# EAGLE board Aquila_mobile (EAGLE 6.3), part 1 of 2
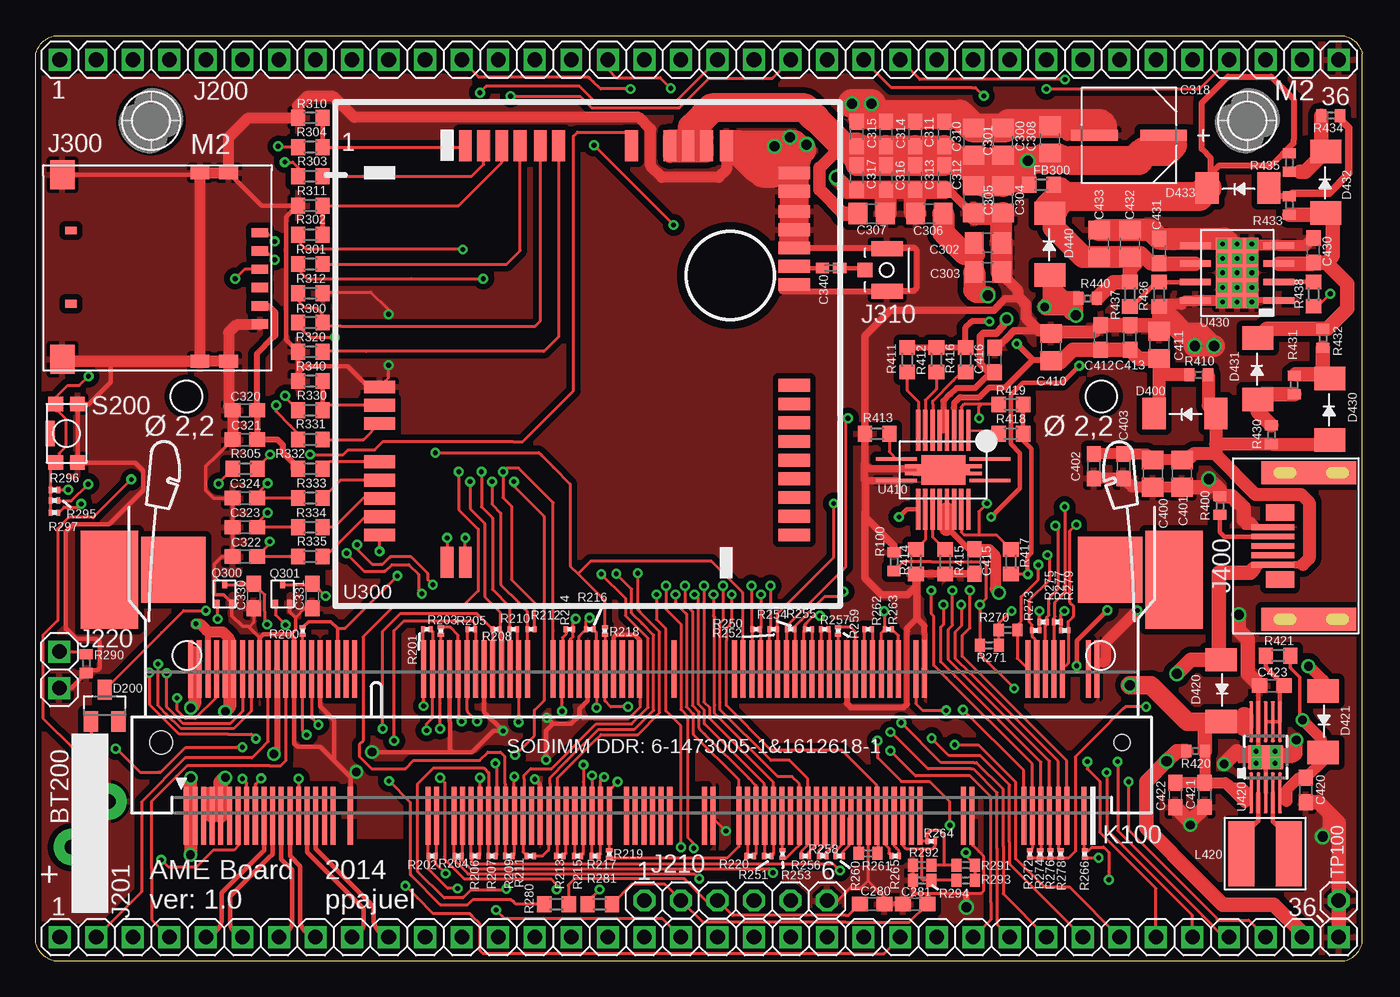
[diagram p6: board, top side]
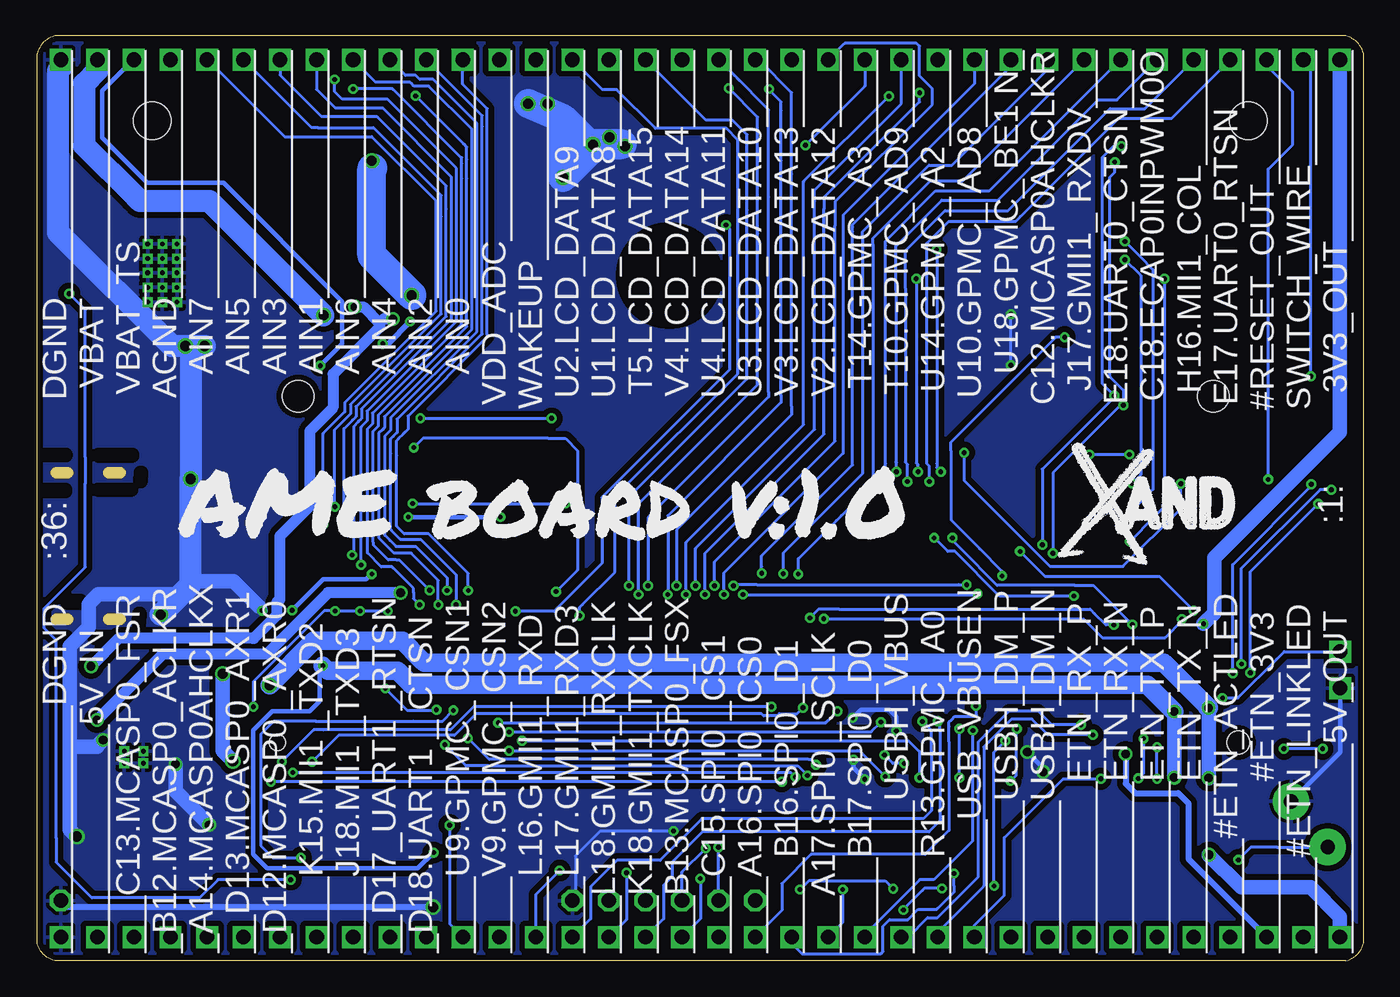
[diagram p7: board, bottom side, seen from below]

Size 92.2 x 64.26 mm. Coordinates in mm from the lower left corner, seen from the top.
Outline: 1.22,0 90.98,0 arc60 92.2,1.22 92.2,63.04 arc60 90.98,64.26 1.22,64.26 arc60 0,63.04 0,1.22 arc60 1.22,0
Copper layers (1*16): Top 0.0356mm / dielectric 1.5011mm / Bottom 0.0356mm
Design rules "LaenPCBOrder": minimum track width 6mil, minimum drill 13mil, track to track 6mil, track to pad 6mil, pad to pad 6mil, via to via 6mil, smd to smd 6mil, copper to edge 15mil, drill to drill 6mil, minimum pad ring 7mil, minimum via ring 7mil, stop-mask expansion 3mil, vias tented up to drill 0mil, thermal gap 10mil
Net classes: 0 default: width 0.203 mm, drill 0.33 mm, clearance 0.152 mm
tKeepout: area 51.7,48.8 to 53.7,49; area 51.7,47.5 to 53.7,47.7
tRestrict: area 46.9,46.2 to 49.7,49; area 53.9,48.6 to 57.9,49.2; area 53.9,46.8 to 57.9,47.6; area 60.4,46.9 to 60.8,49.2; area 50.9,48.8 to 51.5,49.5; area 58.1,47.2 to 60.2,48.8; area 20.3,7.4 to 25.8,8; area 50.9,46.6 to 51.5,47.3
bRestrict: area 46.9,46.2 to 49.7,49; area 87.1,22.5 to 88.2,22.5; area 85.6,32.7 to 88,32.7; area 85.6,35.1 to 87.9,35.2; area 85,33.3 to 85,33.9; area 90.2,35.1 to 91.7,35.2; area 90.2,32.6 to 91.7,32.7; area 89.2,24.9 to 90.1,25; area 85.1,23.5 to 85.1,24.1; area 90.2,22.4 to 90.7,22.5

## Footprints (pad centres in the part's own frame; a part is rotated, then mirrored left to right if it is on the bottom)
VL-1220/VCN = drill 1 pad 2.54: 1 2.54,3.175; 2 0,0
C0603 = smd 1.1 x 1: 1 -0.85,0; 2 0.85,0
C0805 = smd 1.3 x 1.5: 1 -0.95,0; 2 0.95,0
CAPAE660X800N = smd 3.251 x 0.762: 1 -2.413,0; 2 2.413,0
C0402K = smd 0.925 x 0.74: 1 -0.6,0; 2 0.6,0
SOT23 = smd 1 x 1.4: 1 -0.95,-1.1; 2 0.95,-1.1; 3 0,1.1
SMB = smd 1.62 x 2.18: 1 0.8,1.1; 2 5.08,1.1
R0603 = smd 1 x 1.1: 1 -0.85,0; 2 0.85,0
5,0 = hole 2.6: 0,0
HOLE-2.2 = hole 2.2: 0,0
1X36 = drill 1.016 square: 1 -49.53,0; 2 -46.99,0; 3 -44.45,0; 4 -41.91,0; 5 -39.37,0; 6 -36.83,0; 7 -34.29,0; 8 -31.75,0; 9 -29.21,0; 10 -26.67,0; 11 -24.13,0; 12 -21.59,0; 13 -19.05,0; 14 -16.51,0; 15 -13.97,0; 16 -11.43,0; 17 -8.89,0; 18 -6.35,0; 19 -3.81,0; 20 -1.27,0; 21 1.27,0; 22 3.81,0; 23 6.35,0; 24 8.89,0; 25 11.43,0; 26 13.97,0; 27 16.51,0; 28 19.05,0; 29 21.59,0; 30 24.13,0; 31 26.67,0; 32 29.21,0; 33 31.75,0; 34 34.29,0; 35 36.83,0; 36 39.37,0
1X06 = drill 1.016 octagon: 1 -6.35,0; 2 -3.81,0; 3 -1.27,0; 4 1.27,0; 5 3.81,0; 6 6.35,0
1X02 = drill 1.016 square: 1 -1.27,0; 2 1.27,0
78646-3001 = smd 1.15 x 0.65: C1 0,9.025; C2 0,6.485; C3 0,3.945; C5 0,10.295; C6 0,7.755; C7 0,5.215 | smd 1.3 x 0.9: GND1 2.17,12.87; GND2 4.17,12.87; GND5 4.17,-0.225; GND6 2.17,-0.225 | smd 1.7 x 2: GND3 13.73,12.73; GND4 13.73,-0.08 | smd 0.8 x 0.54: X1 13.15,8.87; X2 13.15,3.79
U.FL_RECEPTACLE = smd 1.05 x 1: 1 0,0 | smd 2.2 x 1.05: 2 1.525,1.475; 3 1.525,-1.475
10103593-0001LF = smd 0.4 x 3: 1 -1.3,4.5; 2 -0.65,4.5; 3 0,4.5; 4 0.65,4.5; 5 1.3,4.5 | smd 1.15 x 2: P$6 2.32,4; P$7 -2.32,4 | smd 1.6 x 6.6: P$8 -5.1,2; P$9 5.1,2
1-1376408-1_REDUCED = smd 0.35 x 4: 1 -31.65,-5.1; 2 -31.35,5.1; 3 -31.05,-5.1; 4 -30.75,5.1; 5 -30.45,-5.1; 6 -30.15,5.1; 7 -29.85,-5.1; 8 -29.55,5.1; 9 -29.25,-5.1; 10 -28.95,5.1; 11 -28.65,-5.1; 12 -28.35,5.1; 13 -28.05,-5.1; 14 -27.75,5.1; 15 -27.45,-5.1; 16 -27.15,5.1; 17 -26.85,-5.1; 18 -26.55,5.1; 19 -26.25,-5.1; 20 -25.95,5.1; 21 -25.65,-5.1; 22 -25.35,5.1; 23 -25.05,-5.1; 24 -24.75,5.1; 25 -24.45,-5.1; 26 -24.15,5.1; 27 -23.85,-5.1; 28 -23.55,5.1; 29 -23.25,-5.1; 30 -22.95,5.1; 31 -22.65,-5.1; 32 -22.35,5.1; 33 -22.05,-5.1; 34 -21.75,5.1; 35 -21.45,-5.1; 36 -21.15,5.1; 38 -20.55,5.1; 39 -20.25,-5.1; 40 -19.95,5.1; 44 -15.15,5.1; 45 -14.85,-5.1; 46 -14.55,5.1; 47 -14.25,-5.1; 48 -13.95,5.1; 50 -13.35,5.1; 51 -13.05,-5.1; 52 -12.75,5.1; 53 -12.45,-5.1; 54 -12.15,5.1; 55 -11.85,-5.1; 56 -11.55,5.1; 57 -11.25,-5.1; 58 -10.95,5.1; 59 -10.65,-5.1; 60 -10.35,5.1; 61 -10.05,-5.1; 62 -9.75,5.1; 63 -9.45,-5.1; 64 -9.15,5.1; 65 -8.85,-5.1; 66 -8.55,5.1; 67 -8.25,-5.1; 68 -7.95,5.1; 69 -7.65,-5.1; 71 -7.05,-5.1; 73 -6.45,-5.1; 74 -6.15,5.1; 75 -5.85,-5.1; 76 -5.55,5.1; 77 -5.25,-5.1; 78 -4.95,5.1; 79 -4.65,-5.1; 80 -4.35,5.1; 81 -4.05,-5.1; 82 -3.75,5.1; 83 -3.45,-5.1; 84 -3.15,5.1; 85 -2.85,-5.1; 86 -2.55,5.1; 87 -2.25,-5.1; 88 -1.95,5.1; 90 -1.35,5.1; 91 -1.05,-5.1; 92 -0.75,5.1; 93 -0.45,-5.1; 94 -0.15,5.1; 95 0.15,-5.1; 97 0.75,-5.1; 99 1.35,-5.1; 101 1.95,-5.1; 102 2.25,5.1; 109 4.35,-5.1; 111 4.95,-5.1; 116 6.45,5.1; 117 6.75,-5.1; 118 7.05,5.1; 119 7.35,-5.1; 120 7.65,5.1; 121 7.95,-5.1; 122 8.25,5.1; 123 8.55,-5.1; 124 8.85,5.1; 125 9.15,-5.1; 126 9.45,5.1; 127 9.75,-5.1; 128 10.05,5.1; 129 10.35,-5.1; 130 10.65,5.1; 131 10.95,-5.1; 132 11.25,5.1; 133 11.55,-5.1; 134 11.85,5.1; 135 12.15,-5.1; 136 12.45,5.1; 137 12.75,-5.1; 138 13.05,5.1; 139 13.35,-5.1; 140 13.65,5.1; 141 13.95,-5.1; 142 14.25,5.1; 143 14.55,-5.1; 144 14.85,5.1; 145 15.15,-5.1; 146 15.45,5.1; 147 15.75,-5.1; 148 16.05,5.1; 149 16.35,-5.1; 150 16.65,5.1; 151 16.95,-5.1; 152 17.25,5.1; 153 17.55,-5.1; 154 17.85,5.1; 155 18.15,-5.1; 157 18.75,-5.1; 158 19.05,5.1; 159 19.35,-5.1; 160 19.65,5.1; 169 22.35,-5.1; 171 22.95,-5.1; 183 26.55,-5.1; 184 26.85,5.1; 185 27.15,-5.1; 186 27.45,5.1; 187 27.75,-5.1; 188 28.05,5.1; 189 28.35,-5.1; 190 28.65,5.1; 191 28.95,-5.1; 192 29.25,5.1; 193 29.55,-5.1; 197 30.75,-5.1; 198 31.05,5.1; 200 31.65,5.1 | smd 4.5 x 4.6: M1 -32.55,12; M2 32.55,12 | smd 4 x 6.8: M3 -37,11.3; M4 37,11.3 | hole 1.6: -33.4,0 | hole 1.1: 33.4,0
SDR0403 = smd 4.5 x 1.8: 1 0,1.65; 2 0,-1.65
SOT-416 = smd 0.356 x 0.508: 1 -0.5,0; 2 0.5,0; 3 0,1.295
R0402 = smd 0.7 x 0.9: 1 -0.65,0; 2 0.65,0
R0201 = smd 0.28 x 0.43: 1 -0.255,0; 2 0.255,0
KMR231G = smd 1.016 x 1.016: 1 1.524,4.064; 2 0,4.064; 3 0,0; 4 1.524,0 | smd 0.635 x 1.778: 5 1.905,2.032
1X01 = drill 1.016 octagon: 1 0,0
QUECTEL_M10 = smd 2.159 x 0.889: 8 0,12.192; 9 0,10.922; 10 0,9.652; 12 0,6.985; 13 0,5.715; 14 0,4.445; 15 0,3.175; 16 0,1.905; 33 28.829,1.905; 34 28.829,3.205; 35 28.829,4.505; 36 28.829,5.805; 37 28.829,7.105; 38 28.829,8.405; 39 28.829,9.705; 40 28.829,11.005; 41 28.829,12.305; 42 28.829,19.304; 43 28.829,20.574; 44 28.829,21.844; 45 28.829,23.114; 46 28.829,24.384; 47 28.829,25.781; 48 28.829,27.051 | smd 0.889 x 2.159: 17 4.699,0; 18 5.969,0; 49 24.13,28.956; 50 22.733,28.956; 51 21.463,28.956; 52 20.193,28.956; 54 17.526,28.956; 58 12.446,28.956; 59 11.176,28.956; 60 9.779,28.956; 61 8.509,28.956; 62 7.239,28.956; 63 5.969,28.956
BQ24032ARHLR = smd 2.85 x 0.25: 1 -3.25,-0.75; 10 3.25,-0.75; 11 3.25,0.75; 20 -3.25,0.75 | smd 0.3 x 2.85: 2 -1.75,-2.75; 3 -1.25,-2.75; 4 -0.75,-2.75; 5 -0.25,-2.75; 6 0.25,-2.75; 7 0.75,-2.75; 8 1.25,-2.75; 9 1.75,-2.75; 12 1.75,2.75; 13 1.25,2.75; 14 0.75,2.75; 15 0.25,2.75; 16 -0.25,2.75; 17 -0.75,2.75; 18 -1.25,2.75; 19 -1.75,2.75 | smd 3.05 x 2.05: 21 0,0 | smd 0.85 x 0.25: P$18 -2.25,-0.25; P$19 2.25,-0.25; P$20 -2.25,0.25; P$23 2.25,0.25 | smd 0.5 x 0.75: P$26 -1.6,0; P$27 1.6,0
DRC-S-PVSON-N10 = smd 0.28 x 2.85: 1 -1,-2.475; 2 -0.5,-2.475; 3 0,-2.475; 4 0.5,-2.475; 5 1,-2.475; 6 1,2.475; 7 0.5,2.475; 8 0,2.475; 9 -0.5,2.475; 10 -1,2.475 | drill 0.33 pad 0.61 square: EXP@1 -0.662,0.412; EXP@2 -0.659,-0.413; EXP@3 0.662,0.412; EXP@4 0.662,-0.413 | smd 2.4 x 1.65: TH 0,0
8SO_POWERPAD = smd 0.45 x 2.15: 1 -1.905,-2.9; 2 -0.635,-2.9; 3 0.635,-2.9; 4 1.905,-2.9; 5 1.905,2.9; 6 0.635,2.9; 7 -0.635,2.9; 8 -1.905,2.9 | drill 0.33 pad 0.61 square: EXP@1 -2.032,1.016; EXP@2 0,1.016; EXP@6 2.007,1.016; EXP@7 -1.016,1.016; EXP@8 -2.032,0; EXP@9 -2.032,-1.016; EXP@10 -1.016,0; EXP@11 2.007,-1.016; EXP@14 0.991,1.016; EXP@15 -1.016,-1.016; EXP@16 0,0; EXP@17 0,-1.016; EXP@18 0.991,-1.016; EXP@24 2.007,0; EXP@25 0.991,0 | smd 4.9 x 2.95: TERM 0,0

## Placement (x,y rotation side)
BT200  VL-1220/VCN  [VL-1220/VCN]  5.03,11.07 180 top
C280  47p  [C0603]  58.12,3.94 0 top
C281  47p  [C0603]  61.11,3.94 180 top
C300  47u  [C0805]  67.21,56.92 90 top
C301  47u  [C0805]  65.18,56.92 90 top
C302  47u  [C0805]  66.17,49.89 0 top
C303  47u  [C0805]  66.17,47.85 0 top
C304  47u  [C0805]  67.21,52.9 270 top
C305  47u  [C0805]  65.18,52.91 270 top
C306  47u  [C0805]  62.1,51.92 180 top
C307  47u  [C0805]  58.09,51.92 0 top
C308  47u  [C0805]  70.48,57.07 90 top
C310  100n  [C0603]  63.14,57.45 270 top
C311  100n  [C0603]  61.11,57.45 270 top
C312  100n  [C0603]  63.14,54.43 90 top
C313  100n  [C0603]  61.11,54.43 90 top
C314  47p  [C0603]  59.08,57.45 270 top
C315  47p  [C0603]  57.05,57.45 270 top
C316  47p  [C0603]  59.08,54.43 90 top
C317  47p  [C0603]  57.05,54.43 90 top
C318  680u  [CAPAE660X800N]  75.97,57.35 180 top
C320  47p  [C0603]  14.53,38.25 180 top
C321  100n  [C0603]  14.53,36.22 180 top
C322  47p  [C0603]  14.53,28.09 180 top
C323  47p  [C0603]  14.53,30.12 180 top
C324  47p  [C0603]  14.53,32.16 180 top
C330  100n  [C0603]  15.14,25.35 270 top
C331  100n  [C0603]  19.2,25.35 270 top
C340  22p  [C0402K]  55.27,48.13 0 top
C400  47u  [C0805]  77.62,33.86 270 top
C401  47u  [C0805]  79.65,33.86 270 top
C402  100n  [C0603]  73.53,34.37 270 top
C403  47p  [C0603]  75.59,34.37 270 top
C410  47u  [C0805]  70.56,42.65 90 top
C411  47u  [C0805]  78.08,42.8 90 top
C412  100n  [C0603]  74.02,43.31 90 top
C413  47p  [C0603]  76.05,43.31 90 top
C415  10u  [C0603]  65.23,27.74 90 top
C416  10u  [C0603]  66.65,41.76 270 top
C420  10u  [C0603]  88.27,11.86 270 top
C421  10u  [C0603]  81.24,11.53 270 top
C422  10u  [C0603]  79.2,11.53 270 top
C423  100n  [C0603]  85.9,19.13 180 top
C430  10u  [C0603]  88.8,49.38 90 top
C431  10u  [C0603]  78.08,49.33 90 top
C432  47u  [C0805]  76.05,49.83 90 top
C433  47u  [C0805]  73.89,49.83 90 top
D200  BAS40  [SOT23]  4.78,17.73 0 top
D400  STPS340U  [SMB]  82.8,39.14 180 top
D420  STPS340U  [SMB]  81.28,21.72 270 top
D421  STPS340U  [SMB]  88.37,19.56 270 top
D430  STPS340U  [SMB]  91.03,35.38 90 top
D431  STPS340U  [SMB]  86.03,38.2 90 top
D432  STPS340U  [SMB]  90.75,51.16 90 top
D433  STPS340U  [SMB]  86.49,54.79 180 top
D440  STPS340U  [SMB]  71.58,46.86 90 top
FB300  BLM18S  [R0603]  69.88,53.92 180 top
H1  MOUNT-HOLE-M2  [5,0]  84.2,58.37 0 top
H2  MOUNT-HOLE-M2  [5,0]  8,58.37 0 top
H5  MOUNT_HOLE_2.2  [HOLE-2.2]  74.05,39.23 0 top
H6  MOUNT_HOLE_2.2  [HOLE-2.2]  10.45,39.23 0 top
J200  DNI  [1X36]  51.18,62.61 0 top
J201  DNI  [1X36]  51.18,1.65 0 top
J210  DNI  [1X06]  48.64,4.19 180 top
J220  DNI  [1X02]  1.63,20.22 270 top
J300  78646-3001  [78646-3001]  15.57,54.53 180 top
J310  U.FL_CONNECTOR  [U.FL_RECEPTACLE]  57.63,48.01 0 top
J400  10103593  [10103593-0001LF]  90.47,28.83 90 top
K100  1376408-1_DDR1_1.8V_REDUCED  [1-1376408-1_REDUCED]  42.1,15.18 0 top
L420  SDR0403-2R2ML  [SDR0403]  85.45,7.44 270 top
Q300  DTC143ZET1G  [SOT-416]  13.11,24.84 0 top
Q301  DTC143ZET1G  [SOT-416]  17.14,24.84 0 top
R100  0R  [R0402]  59.64,27.74 270 top
R200  0R  [R0201]  18.54,22.91 90 top
R201  0R  [R0201]  27.18,23.04 0 top
R202  0R  [R0201]  27.53,7.29 0 top
R203  0R  [R0201]  28.14,22.91 90 top
R204  0R  [R0201]  29.34,7.29 0 top
R205  0R  [R0201]  30.25,23.04 0 top
R206  0R  [R0201]  30.52,7.29 0 top
R207  0R  [R0201]  31.7,7.29 0 top
R208  0R  [R0201]  31.98,23.04 0 top
R209  0R  [R0201]  32.87,7.29 0 top
R210  0R  [R0201]  33.17,23.04 0 top
R211  0R  [R0201]  34.37,7.29 0 top
R212  0R  [R0201]  34.42,23.04 0 top
R213  0R  [R0201]  36.42,7.29 0 top
R214  0R  [R0201]  37.08,23.04 0 top
R215  0R  [R0201]  37.64,7.29 0 top
R216  0R  [R0201]  38.51,23.04 0 top
R217  0R  [R0201]  38.86,7.29 0 top
R218  0R  [R0201]  39.55,22.91 90 top
R219  0R  [R0201]  39.85,7.42 270 top
R220  0R  [R0201]  49.66,7.29 0 top
R250  0R  [R0201]  50.05,23.04 0 top
R251  0R  [R0201]  50.88,7.29 0 top
R252  0R  [R0201]  51.25,23.04 0 top
R253  0R  [R0201]  51.89,7.42 270 top
R254  0R  [R0201]  52.47,23.04 0 top
R255  0R  [R0201]  53.7,23.04 0 top
R256  0R  [R0201]  53.47,7.29 0 top
R257  0R  [R0201]  54.82,23.04 0 top
R258  0R  [R0201]  54.69,7.29 0 top
R259  0R  [R0201]  55.75,22.91 90 top
R260  0R  [R0201]  55.83,7.29 0 top
R261  0R  [R0402]  57.84,7.47 0 top
R262  0R  [R0201]  57.84,23.04 0 top
R263  0R  [R0201]  59.26,23.04 0 top
R264  0R  [R0201]  62.23,8.31 0 top
R265  0R  [R0201]  59.72,7.29 180 top
R266  0R  [R0201]  72.9,7.42 90 top
R270  1K  [R0402]  67.56,22.99 180 top
R271  1K  [R0402]  66.27,21.92 0 top
R272  0R  [R0201]  69.09,7.42 90 top
R273  0R  [R0201]  69.49,22.96 180 top
R274  0R  [R0201]  69.8,7.42 90 top
R275  0R  [R0201]  70,23.55 0 top
R276  0R  [R0201]  70.51,7.42 90 top
R277  0R  [R0201]  70.99,23.55 180 top
R278  0R  [R0201]  71.22,7.42 90 top
R279  0R  [R0201]  71.5,22.96 0 top
R280  1K  [R0603]  36.2,3.94 180 top
R281  1K  [R0603]  39.19,3.94 180 top
R290  0R  [R0402]  3.51,20.65 90 top
R291  10K  [R0402]  64.62,6.65 0 top
R292  10K  [R0402]  61.59,6.65 0 top
R293  10K  [R0402]  64.62,5.59 0 top
R294  10K  [R0402]  61.59,5.59 0 top
R295  0R  [R0201]  1.3,31.98 180 top
R296  0R  [R0201]  1.3,32.72 180 top
R297  0R  [R0201]  1.3,31.14 180 top
R300  1K  [R0603]  19.08,44.35 0 top
R301  1K  [R0603]  19.08,48.41 0 top
R302  1K  [R0603]  19.08,50.44 0 top
R303  1K  [R0603]  19.08,54.51 0 top
R304  1K  [R0603]  19.08,56.54 0 top
R305  1K  [R0603]  14.53,34.19 0 top
R310  5K6  [R0603]  19.08,58.57 180 top
R311  5K6  [R0603]  19.08,52.48 180 top
R312  5K6  [R0603]  19.08,46.38 0 top
R320  0R  [R0603]  19.08,42.32 180 top
R330  1K  [R0603]  19.08,38.25 0 top
R331  1K  [R0603]  19.08,36.22 0 top
R332  0R  [R0603]  19.08,34.19 0 top
R333  22R  [R0603]  19.08,32.16 0 top
R334  22R  [R0603]  19.08,30.12 0 top
R335  22R  [R0603]  19.08,28.09 0 top
R340  5K6  [R0603]  19.08,40.28 180 top
R400  0R  [R0402]  82.29,31.64 270 top
R410  0R  [R0402]  80.82,40.72 180 top
R411  100K  [R0603]  60.55,41.76 270 top
R412  100K  [R0603]  62.59,41.76 270 top
R413  1K  [R0603]  58.47,36.63 0 top
R414  36K  [R0603]  61.16,27.74 90 top
R415  30K1  [R0603]  63.2,27.74 90 top
R416  100K  [R0603]  64.62,41.76 270 top
R417  100K  [R0603]  67.77,27.74 270 top
R418  100K  [R0603]  67.77,36.63 0 top
R419  100K  [R0603]  67.77,38.66 0 top
R420  0R  [R0402]  80.6,14.58 0 top
R421  100R  [R0603]  86.33,21.21 0 top
R430  0R  [R0402]  85.88,36.55 90 top
R431  0R  [R0402]  87.45,40.01 90 top
R432  0R  [R0402]  89.46,43.26 90 top
R433  0R  [R0402]  87.12,52.48 90 top
R434  0R  [R0402]  89.99,58.72 180 top
R435  0R  [R0402]  87.12,55.47 90 top
R436  30K1  [R0603]  78.07,46.31 90 top
R437  222740R  [R0603]  76.04,46.32 270 top
R438  1K  [R0603]  88.8,46.33 90 top
R440  0R  [R0402]  73.1,46.02 0 top
S200  KMR231G  [KMR231G]  2.9,38.68 180 top
TP100  DNI  [1X01]  90.55,4.19 0 top
U300  QUECTEL_M10_R  [QUECTEL_M10]  23.88,27.69 0 top
U410  BQ24032ARHLR  [BQ24032ARHLR]  63.07,34.11 180 top
U420  TPS63002DRC  [DRC-S-PVSON-N10]  85.47,14.15 0 top
U430  TPS7A7001  [8SO_POWERPAD]  83.49,47.8 90 top

## Tracks (layer width: path | path; a pad name or v marks a point on that pad's centre or on a via)
5V  (via drill 0.33 pad 0.13)
  Top 0.203: 63.01,42.61 62.76,42.85 | 62.76,42.85 62.97,42.85 62.99,42.85 | 62.76,42.85 62.76,42.78 R412.1
  Top 0.305: U410.4 63.82,38.39 63.8,38.41
  Top 0.406: 63.8,38.41 63.82,38.42 63.82,38.75 64.11,39.04 64.24,39.17 65.58,39.17 66.12,39.7 66.27,39.85 67.39,39.85 68,40.46 69.29,41.76 | 69.29,41.76 70.5,41.76 C410.1 | 78.08,38.4 D400.2 | R411.1 R412.1 R416.1 64.62,44.02 64.95,44.35 65.02,44.42 v66.27,44.42 | 69.29,41.76 v68.17,42.88
  Top 0.889: 78.08,38.4 78.08,40.79 | 78.08,40.79 C411.1 | R410.2 78.16,40.72 78.08,40.79
  Top 1.016: C411.1 76.66,41.85 C413.1 C412.1 72.07,42.46 71.2,41.58 70.68,41.58 C410.1
  Bottom 0.406: v68.17,42.88 67.82,42.88 v66.27,44.42
5V_IN  (via drill 0.7 pad 0.13)
  Top 0.254: 84.66,27.23 85.07,27.23 85.37,27.53
  Top 0.406: 85.38,27.53 J400.1 85.37,27.53 87.53,27.53 | 79.65,34.95 C401.1 79.8,34.95 | 89.32,36.33 D430.1 89.97,36.22 90.55,36.22 90.23,35.9 | 81.95,38.09 D400.1
  Top 0.508: 87.53,27.53 88.06,27.53
  Top 0.762: C401.1 C400.1 77.21,35.22 C403.1 C402.1
  Top 0.889: 88.06,27.53 88.49,27.96 88.49,31.85 87.94,32.41 84.78,32.41 84.73,32.46 81.94,35.26 | 79.8,34.95 80.19,34.95 80.49,35.26 81.94,35.26 | 82,35.92 D400.1 81.47,38.57 R410.1 | 82,35.92 82,35.32 81.94,35.26 | 82,35.92 82.02,35.9 R430.1 89.65,35.9 D430.1
  Top 1.016: J201.35 88.01,1.96 86.06,3.91 82.5,3.91 80.8,5.61 77.17,9.25 77.17,12.45 v78.59,13.87 79.3,14.58 R420.1 | v79.3,19.94 80.28,20.92 D420.1 82.22,21.08 82.22,26.98 84.4,26.98 84.66,27.23
  Bottom 1.016: v79.3,19.94 79.3,14.58 v78.59,13.87
5V_OUT  (via drill 0.6, 0.6 pad 0.13, 0.7 pad 0.13)
  Top 0.203: 11.02,21.44 10.75,21.17 K100.2 K100.4
  Top 0.254: 83.95,16.61 83.95,16.94 84,16.99 | 83.97,16.28 84.13,16.28 U420.10 | 82.86,12.27 83.88,12.27 U420.1
  Top 0.305: 10.77,10.36 K100.3 10.74,9.77 | 82.41,16.61 D420.2
  Top 0.356: K100.1 K100.3 | C421.1 81.47,12.38
  Top 0.406: 10.77,10.36 10.77,10.39 | 82.88,16.61 82.41,16.61 D420.2
  Top 0.762: R420.2 81.25,12.39 C421.1 C422.1 | 81.47,12.38 82.66,12.38 84.05,11 84.05,11.79 83.92,11.91 83.21,11.91 82.86,12.27
  Top 0.914: 11.02,21.44 11.02,17.83 v10.77,17.58 | 10.77,10.39 v10.77,12.7 | 10.74,9.77 v10.74,7.37
  Top 1.016: 82.88,16.61 83.95,16.61 | R420.2 81.25,16.43 81.43,16.61
  Top 1.27: v76.05,19.15 77.5,19.15 78.56,18.09 79.65,16.99 80.03,16.61 81.43,16.61 82.88,16.61 | 84,16.99 84,16.31 83.97,16.28
  Bottom 1.016: v10.77,17.58 v10.77,12.7 | v10.74,7.37 10.74,7.34 8.51,5.11 3.68,5.11 1.65,3.07 J201.1
  Bottom 1.27: 10.87,17.58 v10.77,17.58 13.89,20.7 65.28,20.7 65.35,20.78 65.43,20.85 65.53,20.95 66.8,22.23 72.97,22.23 v76.05,19.15
#ETN_ACTLED
  Top 0.203: K100.24 17.37,20.26 17.37,14.71 17.37,13.92 17.02,13.56 16.23,13.56 10.62,13.56 10.59,13.56 10.57,13.56 10.52,13.56 9.91,12.95 | 9.91,12.95 9.78,12.83 | 9.91,12.95 8.05,11.1 8.05,6.4 8.05,2.87 J201.4
#ETN_LINKLED
  Top 0.203: 4.24,1.65 J201.2 6.66,4.12 6.99,4.45 | K100.20 16.15,15.24 15.6,14.68 15.19,14.28 15.01,14.1 10.39,14.1 7.34,11.05 7.34,4.8 | 6.99,4.45 7.06,4.52 7.34,4.8 | 7.34,4.8 6.99,4.45
#POR  (via drill 0.33 pad 0.13)
  Top 0.203: K100.16 14.96,20.27 14.96,17.35 13.74,16.13 10.69,16.13 10.08,16.13 9.07,17.14 8.59,17.63 8.48,17.73 v8.48,20.62 | R296.1 1.58,32.74 v2.23,32.74
  Bottom 0.203: v8.48,20.62 8.48,27.28 3.02,32.74 v2.23,32.74
#POWER_KILL  (via drill 0.33 pad 0.13)
  Top 0.203: 14.35,17.35 14.35,17.33 | K100.14 14.35,17.33 | 14.35,17.33 13.51,16.48 10.26,16.48 10.24,16.48 9.22,17.5 9.09,17.63 v9.09,19.99 | R295.1 1.58,31.95 2.46,31.95 v3.63,33.12
  Bottom 0.203: v9.09,19.99 9.09,27.53 3.63,32.99 v3.63,33.12
#RESET_OUT  (via drill 0.33 pad 0.13)
  Top 0.203: K100.15 14.65,12.35 v14.35,12.65 | v2.85,14.73 2.62,14.73 0.48,16.87 0.48,22.63 1.47,23.62 1.5,23.62 1.5,30.02 2.29,30.81 3.91,30.81 3.99,30.81 v6.63,33.45 | v5.54,14.73 5.61,14.73 6.15,14.2 7.24,13.11 8.53,13.11 8.64,13.11 8.69,13.11 10.41,14.83 v14.35,14.83
  Bottom 0.203: v2.85,14.73 v5.54,14.73 | J200.3 6.73,62.18 4.93,60.38 4.93,56.72 6.63,55.02 v6.63,33.45 | v14.35,12.65 v14.35,14.83
#USBOTG_OC  (via drill 0.33 pad 0.13)
  Top 0.203: R300.1 18.23,44.13 19.02,43.33 v20.78,43.33 | 20.95,23.11 21.49,23.11 v25.12,26.75
  Top 0.254: K100.36 20.95,23.11 20.5,23.57 18.95,23.57 R200.2
  Bottom 0.203: v20.78,43.33 21.39,43.33 27.84,36.88 28.68,36.04 28.68,35.43 28.68,34.72 28.68,30.63 26.67,28.63 25.12,27.08 v25.12,26.75
#WARM_RESET  (via drill 0.33 pad 0.13)
  Top 0.203: K100.17 15.25,12.28 15.44,12.47 v15.65,12.68 | v15.29,15.44 14.99,15.75 13.36,15.75 10.72,15.75 9.96,15.75 8.91,16.79 7.9,17.8 7.87,17.83 v7.87,20.02 | R297.1 1.57,31.14 1.96,31.52 2.92,31.52 v3.15,31.75
  Bottom 0.203: v7.87,20.02 7.87,26.72 7.87,27.03 v3.15,31.75 | v15.29,15.44 15.29,13.03 v15.65,12.68
ADCREFERENCE  (via drill 0.33 pad 0.13)
  Top 0.203: R275.1 R273.1 | R273.1 | R279.1 | R273.1 69.75,23.98 69.75,24.13 v69.75,24.31 | R277.1 R279.1 | R279.1 71.25,23.62 71.25,24.08 v71.48,24.31 | R272.1 R274.1 | R272.1 R276.1 | R272.1 R278.1 | R272.1 71.81,7.16 72.21,7.57 72.24,7.59 72.24,14.17 73.79,15.72 75.56,17.5 75.72,17.65 v77.17,17.65 | R270.2 | R270.2 66.91,23.4 v67.82,24.31 | R271.2 R270.2 | R270.2
  Bottom 0.203: v67.82,24.31 v69.75,24.31 v71.48,24.31 72.26,24.31 77.17,19.41 v77.17,17.65
AGND  (via drill 0.33 pad 0.13)
  Top 0.203: 65.61,21.96 R271.1 | 65.61,21.91 R271.1 | R100.2 59.63,27.08 R100.2 | K100.183 68.65,12.98 68.65,13.23 v64.44,17.45 | R271.1 65.61,21.93 v65.61,24.74 66.04,25.17 66.04,27.61 65.91,27.74 65,27.74 62.23,27.74 60.29,27.74 R100.2 | R271.1 65.62,21.3 v68,18.92 | 80.9,60.58 81.19,60.87 | 81.19,60.87 J200.33 | v70.23,60.58 80.9,60.58 | 80.9,60.58 81.19,60.87
  Bottom 0.203: v65.61,24.74 66.04,25.17 66.04,25.6 66.04,25.88 67.46,27.3 67.54,27.38 68.28,27.38 69.24,28.35 69.24,36.96 69.06,37.13 69.04,37.16 68.91,37.29 68.89,37.31 68.89,38.05 62.69,44.25 62.69,54.36 62.69,55.4 62.69,55.8 62.71,55.8 67.46,60.55 67.49,60.58 69.9,60.58 v70.23,60.58 | v68,18.92 66.5,17.42 64.47,17.42 v64.44,17.45
AIN0  (via drill 0.33)
  Top 0.203: R272.2 69.25,7.84 K100.185 69.25,13.68 63.3,19.63 62.41,20.52 62.41,23.95 62.23,24.13 v62.23,25.73
  Bottom 0.203: v62.23,25.73 62.23,26.92 62.79,27.48 64.87,29.57 64.97,29.67 66.67,29.67 67.13,30.12 67.21,30.2 67.21,35.13 67.21,36.14 67.08,36.27 67.06,36.3 66.73,36.63 66.62,36.73 66.42,36.93 66.42,37.85 60.91,43.36 60.91,43.51 60.91,59.21 62.61,60.91 J200.25
AIN1  (via drill 0.33)
  Top 0.203: K100.186 69.55,22.22 69.37,22.4 69.24,22.53 R273.2 69.24,23.34 69.06,23.52 69.06,24.92 69.06,25.09 70.46,26.49 70.46,28.04 v70.31,28.19
  Bottom 0.203: v70.31,28.19 70.26,28.25 70.16,28.35 70.16,37.16 69.88,37.44 69.65,37.67 69.65,38.35 63.4,44.6 63.4,52.93 63.4,54.46 68.2,59.26 71.48,59.26 72.77,60.55 J200.29
AIN2  (via drill 0.33)
  Top 0.203: R274.2 69.85,7.73 K100.187 69.85,13.81 63.91,19.76 62.89,20.78 62.89,23.19 63.07,23.37 v63.07,24.74
  Bottom 0.203: J200.26 61.27,58.73 61.27,57.96 61.27,43.56 61.29,43.54 67.18,37.64 67.18,36.7 67.21,36.68 67.44,36.45 67.61,36.27 67.61,35.26 67.61,29.95 67.59,29.92 67.56,29.9 66.95,29.29 66.93,29.29 65.53,29.29 63.07,26.82 v63.07,24.74
AIN3  (via drill 0.33)
  Top 0.203: K100.188 70.15,23.44 R275.2 70.26,23.88 70.41,24.03 70.41,24.84 70.41,25.2 71.07,25.86 71.07,30.02 v70.87,30.23
  Bottom 0.203: v70.87,30.23 70.87,36.98 70.28,37.57 70.03,37.82 70.03,38.51 63.75,44.78 63.75,52.22 63.75,53.85 68.56,58.65 68.58,58.67 72.44,58.67 75.31,61.54 J200.30
AIN4  (via drill 0.33)
  Top 0.203: R276.2 70.48,7.7 70.48,10.05 K100.189 70.45,13.87 64.36,19.96 63.42,20.9 63.42,23.04 63.7,23.32 v63.7,25.73
  Bottom 0.203: J200.27 66.6,61.52 65.89,61.52 65.61,61.24 64.67,61.24 61.62,58.19 61.62,57.25 61.62,55.63 61.62,43.71 67.61,37.72 67.61,36.88 67.82,36.68 68.02,36.47 68.02,29.57 67.67,29.21 67.26,28.8 65.89,28.8 63.7,26.62 v63.7,25.73
AIN5  (via drill 0.33)
  Top 0.203: 70.75,23.61 R277.2 | 70.75,23.61 K100.190 | 70.75,23.61 70.75,23.84 70.84,23.93 70.84,24.84 70.84,24.92 71.5,25.58 v71.5,31.55
  Bottom 0.203: v71.5,31.55 71.5,36.91 70.74,37.67 70.69,37.72 70.41,38 70.41,38.66 64.11,44.96 64.11,51.71 64.11,53.19 68.81,57.89 72.69,57.89 73.13,57.89 J200.31
AIN6  (via drill 0.33)
  Top 0.203: R278.2 71.05,7.84 K100.191 71.05,13.86 64.95,19.96 63.91,21.01 63.91,22.86 64.29,23.24 64.31,23.27 v64.31,24.74
  Bottom 0.203: J200.28 68.78,61.16 68.68,61.06 66.29,61.06 66.27,61.04 66.22,60.98 66.02,60.78 64.97,60.78 61.98,57.78 61.98,56.74 61.98,54.36 61.98,43.89 68.05,37.82 68.05,37.06 68.2,36.91 68.43,36.68 68.43,29.36 67.89,28.83 67.39,28.32 66.19,28.32 64.31,26.44 v64.31,24.74
AIN7  (via drill 0.33)
  Top 0.203: K100.192 71.76,20.68 R279.2 71.76,23.57 72.06,23.88 72.14,23.95 72.14,24.64 71.88,24.89 71.88,29.87 v72.31,30.3
  Bottom 0.203: v72.31,30.3 72.31,36.65 71.12,37.85 70.81,38.15 70.81,38.79 64.47,45.14 64.47,48.08 64.47,52.81 68.94,57.28 75.01,57.28 80.34,62.61 J200.32
BAT_TS  (via drill 0.33)
  Top 0.305: v72.52,41.35 71.35,40.18 68.61,40.18 67.79,39.37 67.77,39.34 67.77,35.92 68.4,35.28 68.4,32.84 66.98,31.42 v66.4,30.84 | U410.12 60.55,31.39 v59.99,30.84
  Bottom 0.203: v72.52,41.35 72.49,41.35
  Bottom 0.305: J200.34 85.52,62.61 87.68,60.45 87.68,57.17 84.56,54.05 79.25,54.05 71.12,45.92 70.99,45.8 70.99,42.88 71.12,42.75 v72.52,41.35 | v66.4,30.84 v59.99,30.84
BOOT_MODE  (via drill 0.33 pad 0.13)
  Top 0.203: K100.8 | K100.8 12.55,18.31 11.07,16.84 10.41,16.84 10.39,16.84 9.8,17.42 v9.8,18.26 | J220.1 2.49,21.49 3.32,21.49 R290.2
  Bottom 0.203: v9.8,18.26 8.97,18.26 8.74,18.26 6.04,20.95 5.51,21.49 J220.1
C400
  Top 0.305: C340.1 52.83,48.13 U300.43
DEBUG3V3_RX  (via drill 0.33 pad 0.13)
  Top 0.203: C280.1 56.48,3.15 56.29,3.15 52.68,3.15 48.41,3.15 J210.4 46.58,4.19 45.11,5.66 45.11,5.69 37.44,5.69 37.03,5.28 37.03,5.18 37.03,3.95 R280.1 | v17.32,39.27 17.32,39.16 R330.1 | 18.24,56.55 R304.1 16.89,56.54 v16.84,56.59 | v22.33,28.91 22.33,28.6 23.37,27.56 23.98,27.56 24.11,27.56 24.59,28.04 24.61,28.07 26.09,28.07 27.25,26.9 27.25,26.49 27.25,26.47 v27.58,26.14 | v43.79,26.06 43.79,24.43 44.81,23.42 44.83,23.39 44.83,17.48 45.34,16.97 45.34,16.92 45.34,8.53 45.47,8.41 45.72,8.15 v45.72,7.82
  Bottom 0.203: v22.33,28.91 22.33,29.01 22.33,34.16 17.32,39.17 v17.32,39.27 18.16,40.11 18.16,55.83 17.4,56.59 v16.84,56.59 | v43.79,26.06 43.71,26.14 42.16,26.14 28.14,26.14 v27.58,26.14 | J210.4 47.37,6.17 v45.72,7.82
DEBUG3V3_TX  (via drill 0.33 pad 0.13)
  Top 0.203: 40.04,4.14 R281.1 41.41,5.31 43.71,5.31 J210.5 46.35,2.67 48.92,2.67 56.31,2.67 60.59,2.67 60.69,2.67 C281.1 | v17.3,55.5 17.86,55.5 18.24,55.12 R303.1 | 18.24,36.23 R331.1 18.23,36.64 17.68,37.19 16.69,38.18 v16.69,38.61 | v21.59,28.32 21.59,28.3 22.68,27.2 22.73,27.15 22.81,27.08 24.23,27.08 24.28,27.08 24.74,27.53 25.91,27.53 26.59,26.85 26.59,25.73 | v44.83,7.9 44.83,15.95 44.83,16.03 44.83,16.33 43.79,17.37 43.79,23.06 43.13,23.72 v43.13,25.45 | 26.59,25.73 v26.82,25.5 26.59,25.73
  Bottom 0.203: J210.5 44.83,7.77 v44.83,7.9 | v17.3,55.5 17.3,54.79 17.63,54.46 17.63,40.59 16.69,39.65 v16.69,38.61 16.69,38.53 16.97,38.53 21.59,33.91 v21.59,28.32 | v43.13,25.45 26.87,25.45 v26.82,25.5
DGND  (via drill 0.33, 0.33 pad 0.13, 0.33 pad 0.3, 0.6, 0.6 pad 0.13, 0.6 pad 0.3, 0.7, 0.7 pad 0.13)
  Top 0.203: K100.147 57.84,10.06 57.84,7.24 57.84,6.55 57.84,5.56 | 55.47,4.19 J210.1 55.7,4.19 56.54,5.03 57.3,5.03 57.84,5.56 | 21.87,10.09 K100.39 | 59.74,3.94 C280.2 58.97,4.43 57.84,5.56 | 59.74,3.94 C281.2 60.35,3.94 61.06,4.65 61.09,4.67 61.11,4.7 | 59.61,4.06 59.74,3.94 | C330.2 15.14,23.52 14.8,23.19 | C331.2 18.68,24.5 18.03,23.85 | R436.1 78.46,45.85 | 80.54,45.85 U430.8 | 61.11,4.7 62.84,4.7 64.67,4.7 65.71,4.7 65.89,4.88 65.89,7.26 65.13,8.03 65.13,10.01 K100.171 | R292.1 R294.1 60.95,4.87 61.11,4.7 | 13.4,38.53 C320.2 | C321.2 13.41,36.22 | K100.71 | K100.94 42.01,20.22 42.01,17.65 41.17,16.82 38.76,16.82 38.56,16.82 38,16.82 37.77,17.04 | 19.93,46.47 23.28,46.47 24.51,45.24 v24.51,44.93 | U300.8 24.51,40.51 v24.51,41.38 | K100.111 47.05,9.92 v47.95,9.02 | U410.21 62.77,34.41 60.99,34.41 62.13,34.41 63.1,33.45 | 62.01,34.67 62.51,34.67 U410.21 | 60.99,33.81 62.81,33.81 63.07,33.55 | 64.12,33.55 64.12,34.67 | 65.14,34.41 63.37,34.41 U410.21 | 65.14,33.81 63.37,33.81 U410.21 | 62.32,33.36 62.2,33.36 62.01,33.55 | 65.14,34.41 63.06,34.41 63.04,34.39 62.84,34.39 62,33.55 61.88,33.55 61.32,34.11 | 65.14,34.41 64.82,34.41 64.82,34.11 | 74.22,20.75 74.22,20.74 K100.200 | 83.47,14.56 83.47,14.5 83.82,14.15 | 5.21,41.41 5.62,41.41 5.74,41.53 | C300.2 67.26,57.87 | C317.1 57.09,53.58 57.1,53.59 | 81.53,32.97 v81.53,33.48
  Top 0.254: Q301.2 17.64,24.24 18.03,23.85 18.03,23.01 17.7,22.68 | 15.55,22.44 14.8,23.19 14.75,23.24 14.35,23.24 13.61,23.99 13.61,24.39 Q300.2 13.61,24.88 13.08,25.4 13.03,25.45 12.47,25.45 12.37,25.55 12.37,27.56 12.9,28.09 13.51,28.09 | 13.4,38.53 C320.2 | C322.2 C323.2 C324.2 12.34,32.16 12.14,32.36 11.81,32.69 11.81,33.6 11.81,34.35 12.62,35.16 C321.2
  Top 0.305: K100.18 15.55,22.44 15.65,22.53 15.8,22.68 15.95,22.68 17.7,22.68 17.96,22.43 K100.26 17.95,17.3 17.95,16.67 17.95,15.09 18.19,14.86 19.75,14.86 19.75,14.87 20.77,13.86 | 20.77,13.86 21.87,12.75 | 21.87,12.75 21.87,10.09 K100.39 | J220.2 2.03,18.95 2.45,18.95 R290.1 3.7,20.19 4.24,20.19 4.42,20.37 4.42,22.15 4.19,22.38 2.79,22.38 2.13,23.04 2.08,23.04 2.08,29.82 2.59,30.33 4.32,30.33 5.08,30.33 7.44,32.69 7.44,34.06 6.88,34.62 S200.2 S200.3 3.68,38.68 5.21,40.21 5.21,41.41 4.95,41.66 | 5.88,41.66 5.74,41.53 | 15.53,44.2 J300.C5 | U300.8 23.09,39.88 21.67,41.3 18.69,41.3 18.23,40.83 | R340.2 18.23,40.83 | 18.23,40.83 R320.2 17.37,43.17 17.37,47.45 | J300.GND4 11.26,54.61 J300.GND5 | C322.2 13.51,28.09 | J300.GND6 15.68,52.48 R311.2 18.16,52.48 17.45,51.77 17.37,51.69 17.37,47.45 | R312.2 19.93,46.47 | 17.4,47.42 17.37,47.45 | J300.GND3 | R414.1 | R100.1 59.73,28.39 59.77,28.35 59.77,28.3 | K100.160 | U300.42 52.17,46.99 | 58.53,46.58 58.61,46.51 | C402.2 | 62.32,33.36 63.1,33.45 64.12,33.55 | 21.87,12.75 21.89,12.75 v22.28,13.13 | v23.37,14.5 28.96,14.5 | 28.96,14.5 29.34,14.5 30.33,14.5 31.8,15.98 v32.46,15.98 31.15,17.28 K100.58 | 18.19,58.61 R310.2 | 47.98,56.62 U300.49 | K100.200 73.75,21.79 | 84.34,14.44 U420.EXP@1 84.97,14.72 U420.9 84.97,19.04 C423.2 | U420.EXP@3 85.25,14.28 U420.TH | U420.EXP@4 85.25,13.46 U420.TH | U420.3 U420.TH | 63.07,34.67 U410.21 | U410.21 63.07,33.55 U410.21 | K100.88 40.15,22.48 40.34,22.66 41.58,22.66 41.6,22.66 41.99,22.28 41.99,22.25 41.99,20.31 K100.94 | K100.32 19.75,17.68 20.73,16.71 20.73,13.89 20.77,13.86 | K100.50 28.75,16.61 28.78,16.59 28.78,14.68 28.96,14.5
  Top 0.305: K100.82 38.35,18.57 38.33,18.54 38.33,18.09 37.77,17.53 37.77,17.04 37.19,16.46 35.94,16.46 | K100.71 35.05,12.24 v34.67,12.62 | v35.46,13.97 35.46,15.98 35.94,16.46 | 35.94,16.46 v35.51,16.89
  Top 0.356: C421.2
  Top 0.406: J400.5 85.01,30.13 | 85.01,30.13 84.02,30.13 | K100.160 61.77,20.3 61.77,22.76 61.77,23.27 61.67,23.37 61.27,23.77 | 58.75,49.53 J310.2 | J310.3 58.88,46.78 58.61,46.51 | 59.51,49.53 J310.2 | C311.1 C314.1 59.04,58.34 | C311.1 C310.1 64.74,58.3 C301.2 65.14,57.87 | 59.01,49.53 J310.2 | 53.34,46.99 U300.42 52.3,46.99 51.84,46.53 58.48,46.53 58.53,46.58 | 59.54,46.76 J310.3 | 61.15,58.34 C311.1 | 59.08,51.96 C307.2 | 61.11,51.96 C306.2 61.29,51.78 | C304.2 | C312.1 63.41,53.58 | 65.03,51.96 C305.2 65.61,51.53 65.61,51.49 | C302.2 67.12,49.98 | 84.4,45.9 84.33,45.9 | 83.62,45.9 83.46,46.05 83.46,47.78 U430.EXP@16 | 67.39,47.58 C303.2 67.59,47.38 67.59,47.33 | 67.36,58.02 C300.2 | 71.02,58.01 70.5,58.01 C308.2 | 61.24,26.81 R414.1 | v64.67,3.73 64.67,4.7 | U420.EXP@1 84.42,14.28 U420.TH 84.42,13.46 U420.EXP@2 | 84.4,45.9 84.33,45.9 | U430.5 83.01,49.71 83.49,49.71 | 83.49,49.71 U430.EXP@24 82.98,49.81 U430.EXP@6 | U430.EXP@11 84.51,49.71 U430.EXP@18 | 83.49,49.71 U430.EXP@25 | U430.EXP@18 U430.EXP@25 | U430.EXP@14 U430.EXP@2 | U430.EXP@2 U430.EXP@16 | U430.EXP@16 U430.EXP@25 | U430.EXP@18 84.53,48.79 | 84.53,48.79 84.53,48.9 84.51,48.9 84.51,48.95 | 84.53,48.79 U430.EXP@18 | U430.EXP@18 U430.EXP@17 | U430.EXP@2 U430.EXP@7 | U430.EXP@10 U430.EXP@8 | U430.EXP@15 84.51,45.9 | 84.51,45.9 U430.EXP@9 84.51,45.9 | U430.1 84.51,45.9 | 84.33,45.9 83.97,45.9 83.62,45.9 | 83.62,45.9 83.49,45.9 | 83.49,45.9 U430.EXP@8 | 84.51,45.9 84.4,45.9 | 83.62,45.9 83.49,45.9 | 83.49,45.9 U430.EXP@8 | U430.EXP@8 U430.EXP@1 82.47,45.9 | 70.39,43.76 C410.2 | 78.11,43.71 C411.2 R436.1 | U420.EXP@3 86.55,14.28 | C422.2 | U300.44 61.06,49.53 | 61.06,49.53 61.19,49.4 61.19,46.74 60.98,46.53 J310.3
  Top 0.406: 61.06,49.53 59.21,49.53 J310.2 | K100.142 56.35,17.89 56.64,17.6 60.3,17.6 60.53,17.83 60.55,17.86 60.55,22.91 60.55,23.11 61.24,23.8 | 85.01,30.13 84.58,30.56 84.45,30.66 84.45,30.4 84.4,30.35 84.25,30.35 83.95,30.66 | 75.44,50.78 C432.2 75.44,50.78 | 76.04,44.19 C413.2 76.04,44.19
  Top 0.508: C416.1 66.92,42.88 67.08,42.88 67.51,43.31 67.97,43.76 70.39,43.76 C410.2 | 68.43,46 67.36,46 66.57,45.21 59.38,45.21 57.62,43.45 R413.1 57.62,34.57 | 57.62,34.57 57.62,34.45 57.89,34.19 62.59,34.19 63.07,34.67 | U410.11 57.81,33.36 | 57.81,33.36 57.65,33.36 57.58,33.43 57.58,34.53 57.62,34.57 | R100.1 59.64,28.83 57.66,30.81 57.66,31.27 | 57.66,31.27 57.66,33.21 57.81,33.36 | R414.1 | R414.1 61.16,26.01 60.58,25.43 58.78,25.43 57.89,26.31 57.61,26.59 57.61,31.22 57.66,31.27 | 61.24,26.81 61.24,23.8 61.27,23.77 | R414.1 R415.1 C415.1
  Top 0.559: 63.41,53.58 64.19,52.81 65.03,51.96
  Top 0.762: 52.65,50.11 52.7,50.11 U300.44 | 48.54,56.72 48.01,56.72 U300.49 | C315.1 57.05,58.57 57.66,59.18 | 74.14,57.99 74.14,57.94 C318.2 71.68,57.35 71.02,58.01 | 74.22,20.75 74.32,20.85 74.32,22.05 74.32,22.1 v76.56,24.33 | C423.2 84.96,19.13 | U420.EXP@1 84.23,14.56 83.82,14.15 | C402.2 C403.2 76.2,32.91 77.11,32.91 | C400.2 77.11,32.91 | C401.2 77.11,32.91 | 67.59,47.33 67.59,47.3 67.59,47.24 68.25,46.58 68.25,46.18 68.67,45.76 | 70.39,43.76 69.72,43.76 68.83,44.65 68.83,45.59 68.67,45.76 | 68.67,45.76 68.43,46 | 80.54,45.85 79.86,45.85 79.63,45.62 78.23,45.62 R436.1 | U430.8 83.97,45.9 | C430.2 88.28,49.71 U430.4 83.01,49.71 | 15.53,44.2 13.92,44.2 13.39,43.66 13.39,41.68 | 13.39,41.68 J300.GND1 J300.GND2 4.95,41.66 | 13.39,41.68 13.39,38.55 C320.2 C321.2 | 4.95,41.66 1.98,41.66 | 1.98,41.66 J300.GND3 | 1.98,41.66 4.95,41.66 | 4.95,41.66 J300.GND2 J300.GND5 J300.GND6 13.4,57.22 14.76,58.57 R310.2 18.19,58.61 18.19,59.41 18.85,60.07 20.65,60.07 22.12,58.6 41.91,58.6 42.72,57.78 42.72,55.22 43.51,54.43 47.45,54.43 47.98,54.97 47.98,56.62
  Top 0.889: C410.2 70.85,43.6 70.97,43.71 73.57,43.71 C412.2
  Top 1.016: v52.4,57.23 52.32,57.23 52.32,56.59 | v53.57,56.72 52.53,56.72 52.53,56.59 | v55.65,54.43 56.41,53.67 56.41,53.59 57.1,53.59 57.56,53.59 57.61,53.54 59.04,53.54 C316.1 59.08,52.96 | 61.16,53.06 61.16,53.53 C313.1 62.32,53.58 62.33,53.59 | 83.47,14.56 v82.58,13.66 | v80.24,9.45 80.24,9.64 | 80.24,9.64 C422.2 | 80.24,9.64 80.24,9.68 C421.2 | v83.62,24.05 83.62,22.96 84.15,22.43 84.23,22.35 84.23,19.95 C423.2 | R436.1 78.08,43.69 78.05,43.66 78.05,43.99 78.74,44.68 | C411.2 77.67,44.16 C413.2 C412.2 | 86.55,14.28 87.41,14.28 87.53,14.4 87.53,15.27 v87.61,15.34 | 83.95,30.66 83.95,31.47 83.13,32.28 R400.1 82.29,32.72 v81.53,33.48 | C401.2 81.47,32.91 81.53,32.97 | C420.2 89.14,11.01 89.67,10.48 | 89.67,10.48 89.92,10.24 89.92,9.12 v89.43,8.64 | J201.36 TP100.1 90.55,9.6 89.67,10.48
  Top 1.27: 56.41,53.59 57.1,53.59 62.33,53.59 63.13,53.59 C312.1
  Top 1.524: 59.08,51.96 59.08,52.96 | 61.11,51.96 61.11,53.01 61.16,53.06 | C433.2 C432.2 | C432.2 77.47,50.78 | 77.47,50.78 C431.2 82.61,50.18 82.98,49.81 | 67.12,49.98 67.12,51.86 | 67.12,51.86 C304.2 | 67.12,51.86 65.28,51.86 C305.2 | C302.2 C303.2 | 77.47,50.78 C432.2 | v80.54,42.72 v81.89,42.72 81.71,42.72 80.85,43.59 79.83,43.59 78.74,44.68
  Top 2.032: 52.7,54.2 U300.48 52.7,55.52 52.88,55.7 52.88,55.98 53.14,56.24 | 52.7,54.2 U300.47 | U300.47 U300.46 | U300.46 52.7,51.44 | 52.7,51.44 U300.45 | U300.45 52.7,50.6 | 52.7,50.6 52.7,50.16 52.65,50.11 | U300.47 52.7,54.2 | U300.46 52.7,51.44 | U300.45 52.7,50.6 | 50.52,54.74 51.33,54.74 v51.33,56.59 52.32,56.59 52.53,56.59 52.78,56.34 53.24,56.34 53.14,56.24 | v58.06,59.56 57.66,59.56 | 57.4,58.83 57.71,58.83 | 57.71,58.83 64.22,58.83 C301.2 C300.2 67.26,57.87 67.32,57.87 67.64,58.19 69.75,58.19 73.94,58.19 74.14,57.99 | 57.66,59.56 57.66,59.18 57.66,58.88 57.71,58.83 | 48.54,56.72 48.54,56.62 50.11,55.04 50.11,55.45 48.84,56.72 52.65,56.72 53.14,56.24 | 57.66,59.56 v56.72,59.56
  Bottom 0.203: v47.95,9.02 53.06,9.02 54.48,7.59 54.79,7.29 54.79,4.39 J210.1 | 87.63,15.32 v87.61,15.34 | v24.51,41.38 v24.51,44.93
  Bottom 0.305: J220.2 1.63,14.48 BT200.2 | v22.28,13.13 22.28,13.41 v23.37,14.5 | v32.46,15.98 32.46,16.97 32.94,17.45 34.95,17.45 v35.51,16.89 | v35.46,13.97 35.46,13.41 v34.67,12.62
  Bottom 0.406: 81.53,26.39 81.53,26.14 | v64.67,3.73 90.09,3.73 TP100.1
  Bottom 0.762: 76.76,24.61 76.71,24.61 76.58,24.49 76.58,24.36 v76.56,24.33
  Bottom 1.016: 81.53,26.39 78.54,26.39 76.76,24.61 | v89.43,8.64 89.92,9.12 89.92,21.87 88.59,23.19 88.59,24.79 88.54,24.84 88.54,24.87 87.94,25.48 84.33,25.48 82.19,25.48 81.53,26.14 | v82.58,13.66 82.58,11.79 v80.24,9.45 | 89.43,14.88 88.01,14.88 88.01,14.94 87.63,15.32
  Bottom 1.524: J200.36 90.55,62.03 90.75,61.82 90.75,51.59 90.75,50.62 82.86,42.72 v81.89,42.72 | 81.53,26.39 v81.53,33.48 81.53,42.37 v81.89,42.72 | 81.53,26.14 v83.62,24.05 | v81.89,42.72 v80.54,42.72
  Bottom 2.032: 53.72,56.36 v55.65,54.43 55.65,58.09 55.63,58.12 55.63,58.5 | v53.57,56.72 54.23,56.72 51.56,56.72 51.51,56.77 53.9,56.77 55.63,58.5 | 55.63,58.5 v58.06,59.56
  pour Top (isolate 0.406): -0.43,64.47 92.68,64.47 92.68,56.79 92.71,56.79 92.71,-0.66 -0.43,-0.66
  pour Bottom (isolate 0.406): -2.97,65.96 -2.9,65.96 -2.9,-7.26 99.11,-7.26 99.11,67.28 -2.97,67.28
EHRPWM1A  (via drill 0.33, 0.33 pad 0.13)
  Top 0.203: 58.45,7.49 R261.2 58.51,7.49 58.51,10.08 K100.149 58.45,12.18 56.01,14.63 51.1,14.63 47.98,17.75 47.98,22.25 47.98,23.11 48.36,23.5 v48.36,25.45 | v41.33,60.58 39.24,60.58 38.73,61.09 38.48,61.34 38.41,61.42 30.76,61.42 29.59,62.59 J200.12
  Bottom 0.203: v48.36,25.45 48.36,30.94 40.49,38.81 40.49,39.27 40.49,55.63 40.49,59.08 40.49,59.69 41.33,60.53 v41.33,60.58
EHRPWM1B  (via drill 0.33 pad 0.13)
  Top 0.203: K100.150 58.75,22.79 R263.1 59,24.23 v58.95,24.28 | v44.32,51.13 42.57,52.88 v38.79,56.67
  Bottom 0.203: v44.32,51.13 44.04,50.85 44.04,50.55 44.04,41.1 52.12,33.02 52.93,32.21 52.93,27.61 56.26,24.28 v58.95,24.28 | v38.79,56.67 38.05,57.4 34.67,60.78 J200.14
EHRPWM2A  (via drill 0.33 pad 0.13)
  Top 0.203: R219.2 48.08,7.16 48.87,7.95 48.87,10.06 K100.117 48.85,11.7 48.85,12.59 45.72,15.72 45.72,17.14 45.21,17.65 45.21,24.11 45.19,24.13 45.16,24.16 44.45,24.87 v44.45,25.45
  Bottom 0.203: v44.45,25.45 44.45,26.98 43.99,27.43 36.17,35.26 36.17,51.03 36.17,51.82 27.05,60.94 J200.11
EHRPWM2B  (via drill 0.33 pad 0.13)
  Top 0.203: 51.25,7.41 R251.2 51.25,7.41 | 51.25,7.41 K100.125 51.25,12.04 51.25,12.42 50.98,12.7 46.81,16.87 46.81,17.6 46.43,17.98 46.43,24.92 v46.43,26.06
  Bottom 0.203: v46.43,26.06 46.43,28.65 38.15,36.93 38.15,52.81 38.15,53.54 32.13,59.56 J200.13
ETN_3V3  (via drill 0.6 pad 0.13)
  Top 0.203: 16.76,20.27 K100.22 16.76,20.27
  Top 0.406: 16.76,20.27 16.76,14.61 v16.54,14.38
  Bottom 0.406: v16.54,14.38 16.54,12.32 15.88,11.66 12.88,11.66 12.17,10.95 12.17,7.09 J201.3
ETN_RX_N
  Top 0.305: K100.23 17.05,7.07 17.79,6.33 17.79,2.64 17.79,2.55 arc-60 J201.7
ETN_RX_P
  Top 0.305: K100.25 17.65,7.29 18.38,6.57 18.38,2.64 arc60 19.37,1.65 J201.8
ETN_TX_N
  Top 0.305: K100.19 15.85,8.05 15.85,7.64 15.77,7.57 12.92,4.72 12.92,3.65 12.92,2.74 arc-60 11.82,1.65 J201.5
ETN_TX_P
  Top 0.305: K100.21 16.46,8.05 16.46,7.42 16.18,7.16 13.5,4.48 13.5,3.41 13.5,2.74 13.5,2.5 arc60 J201.6
GPIO0_6  (via drill 0.33 pad 0.13)
  Top 0.203: K100.45 27.25,7.31 R202.1 27.28,6.38 28.63,5.03 v29.31,5.03 | v31.98,3.53 32.41,3.1 32.54,2.97 43.51,2.97 J201.18
  Bottom 0.203: v31.98,3.53 31.98,3.58 30.66,4.9 30.53,5.03 v29.31,5.03
GPIO0_7  (via drill 0.33 pad 0.3)
  Top 0.203: K100.74 35.95,22.26 | 35.94,22.28 35.95,22.26 | R212.2 34.67,24.87 34.59,24.94 33.05,26.49 33.05,31.6 32.46,32.18 v32.46,33.98 32.72,34.24 33.55,34.24 35.95,31.84 35.95,22.95 35.95,22.26
  Bottom 0.203: v32.46,33.98 32.46,34.62 32.51,34.67 32.51,46.61 32.51,49.66 29.31,52.86 25.4,52.86 18.44,59.82 17.96,59.82 17.14,59.82 J200.6
GPIO0_16  (via drill 0.33 pad 0.25)
  Top 0.203: v36.58,17.35 36.58,17.93 36.58,20.26 K100.76 36.6,20.32 36.6,22.45 36.83,22.68 R214.1 | J201.28 67.23,4.65 67.23,4.67 67.23,7.95 67.23,11.33 67.23,11.68 67.23,11.73 67.23,11.91 65.38,13.77 65.2,13.77 62.92,13.77 v60.15,16.54
  Bottom 0.203: 37.31,16.61 37.24,16.69 | 37.24,16.69 v36.58,17.35 | v60.15,16.54 37.39,16.54 37.24,16.69
GPIO0_17  (via drill 0.33 pad 0.25)
  Top 0.203: R215.2 38.05,7.45 K100.81 38.05,12.42 v38.05,13.61 | v62.26,15.47 63.48,14.25 65.63,14.25 67.67,12.22 67.67,11.3 67.67,8.23 67.67,6.76 J201.29
  Bottom 0.203: v38.05,13.61 38.43,13.99 38.58,13.99 60.05,13.99 60.78,13.99 v62.26,15.47
GPIO0_19
  Top 0.203: R213.2 36.85,7.47 K100.77
GPIO0_20  (via drill 0.33 pad 0.13)
  Top 0.203: K100.78 37.15,22.35 37.34,22.53 R214.2 37.34,23.19 37.34,23.6 v37.52,23.77 | v12.62,23.75 12.62,24.82 Q300.1
  Bottom 0.203: v37.52,23.77 37.49,23.75 19.58,23.75 19.46,23.75 18.16,22.45 15.95,22.45 15.72,22.45 13.79,22.45 12.62,23.62 v12.62,23.75
GPIO0_26
  Top 0.203: R255.2 K100.134
GPIO0_27  (via drill 0.33 pad 0.3)
  Top 0.203: R218.2 | R218.2 39.55,25.02 37.67,26.9 | v12.7,33.15 12.7,33.21 R305.1 | R218.2 39.65,23.16 | K100.118 49.1,20.33 49.1,25.6 47.85,26.85 46.94,27.76 38.53,27.76 37.67,26.9 | 37.67,26.9 37.13,27.43 37.13,33.12 35.97,34.29 35.13,35.13 34.95,35.31 v27.76,35.31
  Bottom 0.203: 23.9,29.52 23.65,29.26 | 23.65,29.26 21.79,27.41 16.71,27.41 12.7,31.42 v12.7,33.15 | v27.76,35.31 27.76,33.38 23.65,29.26
GPIO1_8  (via drill 0.33 pad 0.3)
  Top 0.203: R207.2 32.05,7.39 K100.61 32.05,12.12 32.05,13.59 v31.93,13.72 | v33.3,14.3 34.65,15.65 34.65,17.37 34.65,17.42 35.31,18.09 35.31,30.89 33.22,32.97 33.22,33.17 v33.22,33.3
  Bottom 0.203: v31.93,13.72 32.72,13.72 v33.3,14.3 | J200.7 26.01,53.49 29.74,53.49 33.22,50.01 33.22,49.71 33.22,34.57 v33.22,33.3
GPIO1_9  (via drill 0.33 pad 0.3)
  Top 0.203: 32.35,22.92 R208.2 | K100.62 32.35,22.92 | 32.35,22.92 R208.2 | v30.18,33.3 30.18,31.42 31.19,30.4 31.19,25.3 32.26,24.23 32.26,23.06 R208.2
  Bottom 0.203: J200.4 13.36,58.52 17.04,58.52 23.86,51.7 24,51.56 24.18,51.38 28.83,51.38 30.35,49.86 30.35,49.84 30.35,34.54 30.18,34.37 v30.18,33.3
GPIO1_12  (via drill 0.33 pad 0.13)
  Top 0.203: 51.55,22.99 R252.2 | 51.55,22.99 K100.126 | U410.18 64.32,29.79 64.52,29.59 65.53,29.59 | 65.53,29.59 66.25,29.59 66.76,29.59 R417.1 | 51.55,22.99 51.55,23.72 51.55,24.12 | 51.55,24.12 51.55,24.17 | v66.09,31.77 65.53,31.22 65.53,29.59 | v55.45,31.77 55.45,28.02 51.55,24.12
  Bottom 0.203: v66.09,31.77 59.21,31.77 v55.45,31.77
GPIO1_13
  Top 0.203: R256.2 53.72,7.57 54.25,8.1 K100.135
GPIO1_14
  Top 0.203: 49.45,7.34 R220.1 49.45,7.34 | K100.119 49.45,7.34
GPIO1_15
  Top 0.203: 54.55,23.03 R257.1 54.55,23.04 K100.136
GPIO1_16  (via drill 0.33 pad 0.25)
  Top 0.203: 18.55,22.66 R200.1 K100.28 | K100.28 18.52,20.24 18.52,17.6 18.52,16 v18.82,15.7
  Top 0.254: K100.28
  Bottom 0.203: J201.12 29.59,1.98 26.39,5.18 26.39,14.86 26.04,15.21 24.46,16.79 23.04,16.79 21.95,15.7 v18.82,15.7
GPIO1_17
  Top 0.203: R262.2 58.15,22.97 K100.148
GPIO1_20
  Top 0.203: K100.155 60.25,8.02 60.48,7.8 61.62,7.8 | 61.62,7.8 62.33,7.8 62.48,7.95 R264.2 | R293.1 R294.2 61.67,5.59 61.59,5.66 61.59,7.77 61.62,7.8
GPIO1_21
  Top 0.203: K100.154 59.95,22.6 R263.2
GPIO1_22
  Top 0.203: K100.151 59.05,8.05 59.28,7.82 59.28,7.47 R265.2
GPIO1_24  (via drill 0.33 pad 0.13)
  Top 0.203: R266.1 v73.86,7.16 | K100.158 | 61.14,20.29 K100.158 | K100.158 61.15,17.86 61.62,17.4 v63.27,17.4
  Bottom 0.203: v73.86,7.16 75.82,7.16 76.66,8 76.66,15.75 76.02,16.38 75.74,16.66 73.41,16.66 72.82,16.66 66.04,16.66 64.01,16.66 v63.27,17.4
GPIO1_25
  Top 0.203: 61.45,9.77 K100.159 61.42,10.04 61.42,8.31 R264.1 61.98,8.89 62.15,9.07 62.84,9.07 63.12,8.79 63.12,6.66 | R291.1 63.12,6.66 | 63.12,6.66 R292.2
GPIO1_26
  Top 0.203: 59.84,7.82 59.82,7.82 | 59.82,7.82 59.66,7.98 59.66,10.07 K100.153 | R265.1 59.97,7.67 59.82,7.82
GPIO1_28  (via drill 0.33 pad 0.3)
  Top 0.203: R213.1 36.25,7.38 K100.75 36.25,12.28 36.25,12.71 37.31,13.77 38.79,15.24 39.27,15.72 41.83,15.72 43.36,17.25 43.36,22.86 42.04,24.18 41.83,24.38 41.83,26.57 v41.83,26.92
  Bottom 0.203: v41.83,26.92 41.83,27.41 41.83,28.14 35.51,34.47 35.51,50.67 35.51,50.98 35.51,51.16 30.15,56.52 24.51,62.15 J200.10
GPIO1_30  (via drill 0.33 pad 0.13, 0.33 pad 0.25)
  Top 0.203: R206.2 30.85,7.37 K100.57 30.86,10.08 v30.86,12.72 | v63.52,9.42 63.5,9.45 63.5,11.07 62.1,12.47 60.15,12.47 58.52,14.1 58.5,14.12 v58.5,15.29
  Bottom 0.203: 30.86,13.03 v30.86,12.72 30.86,14.53 31.62,15.29 35.2,15.29 v58.5,15.29 | v63.52,9.42 63.52,2.56 J201.25
GPIO1_31  (via drill 0.33 pad 0.13)
  Top 0.203: K100.56 30.55,22.99 R205.2 30.51,23.42 30.3,23.62 29.92,23.62 25.58,23.62 24.89,22.94 v24.89,15.29 | J201.24 58.93,0.51 56.77,0.51 31.06,0.51 30.86,0.71 30.86,2.56 30.33,3.1 30.25,3.17 30.15,3.28 27.61,3.28 26.52,4.37 v25.68,5.21
  Bottom 0.203: v24.89,15.29 25.6,14.58 25.68,14.5 v25.68,5.21
GPIO2_0  (via drill 0.33 pad 0.13)
  Top 0.203: K100.80 37.75,22.54 R216.1 38.25,23.6 v38.48,23.82 | Q301.1 16.64,24.05 v17.35,23.34
  Bottom 0.203: v17.35,23.34 17.91,23.34 18.69,24.13 19,24.43 36.45,24.43 37.01,24.43 37.87,24.43 v38.48,23.82
GPIO2_1
  Top 0.203: R215.1 37.45,7.36 K100.79
GPIO2_6
  Top 0.203: R258.1 54.43,7.67 54.86,8.1 54.86,10.07 K100.137
GPIO2_7
  Top 0.203: R257.2 55.15,22.96 K100.138
GPIO2_8
  Top 0.203: R258.2 54.94,7.54 55.19,7.8 55.45,8.06 K100.139
GPIO2_9
  Top 0.203: R259.1 K100.140
GPIO2_10
  Top 0.203: K100.141 56.03,10.06 56.03,8.13 56.03,8.08 55.8,7.85 55.57,7.62 R260.1
GPIO2_11
  Top 0.203: 51.85,7.71 R253.1 51.85,7.71 | K100.127 51.85,7.71
GPIO2_12  (via drill 0.33 pad 0.13)
  Top 0.203: K100.128 52.15,22.98 R254.1 52.22,23.29 52.65,23.72 56.3,27.37 56.3,37.55 v56.44,37.69 | 65.68,38.66 R419.1 66.6,38.34 | 65.68,38.66 64.52,38.66 64.31,38.46 64.31,36.84 U410.3 | 65.68,38.66 65.61,38.58 65.56,38.53 v65.56,37.69
  Bottom 0.203: v65.56,37.69 57.43,37.69 v56.44,37.69
GPIO2_13  (via drill 0.33 pad 0.13)
  Top 0.203: K100.130 52.75,23.01 R254.2 52.73,23.21 53.21,23.7 53.47,23.95 54.84,25.32 55.8,25.32 v56.13,25.65 | R418.1 66.92,36.49 | v66.02,35.66 66.02,35.72 R418.1 | U410.2 66.71,36.84 R418.1
  Bottom 0.203: v66.02,35.66 65.38,36.3 56.67,36.3 55.47,36.3 54.63,35.46 54.63,27.15 v56.13,25.65
GPIO2_18  (via drill 0.33 pad 0.25)
  Top 0.203: R205.1 29.95,23 K100.54 29.97,20.26 29.97,18.19 29.97,17.4 29.97,17.32 v30.66,16.64
  Bottom 0.203: J201.22 53.72,2.92 53.72,5.16 52.09,6.78 51.89,6.99 48.9,6.99 46,9.88 30.61,9.88 30.05,10.44 30.05,14.55 30.05,15.49 30.05,16.03 v30.66,16.64
GPIO2_19  (via drill 0.33 pad 0.13)
  Top 0.203: R206.1 | R206.1 K100.55 | 30.28,7.28 R206.1 | R206.1 30.27,6.92 30.35,6.83 30.43,6.76 55.4,6.76 v55.88,6.27
  Bottom 0.203: J201.23 57.53,4.62 v55.88,6.27
GPIO2_22
  Top 0.203: K100.144 56.95,22.85 56.64,23.16 R259.2
GPIO2_23
  Top 0.203: R260.2 56.08,7.57 56.52,8 56.52,9.94 K100.143
GPIO2_24
  Top 0.203: R262.1 57.55,23.01 K100.146
GPIO2_25
  Top 0.203: 57.25,7.59 R261.1 57.21,7.49 57.21,10.08 K100.145
GPIO3_0  (via drill 0.33 pad 0.3)
  Top 0.203: K100.68 34.15,22.37 R212.1 34.16,24.28 33.91,24.54 33.58,24.87 32.31,26.14 32.31,31.11 31.7,31.73 v31.7,33.3
  Bottom 0.203: 24.71,52.12 24.43,52.4 | 24.43,52.4 17.63,59.21 15.21,59.21 J200.5 | v31.7,33.3 31.7,34.49 31.85,34.65 31.85,46.74 31.85,49.35 29.08,52.12 24.71,52.12 | 24.71,52.12 24.43,52.4
GPIO3_4  (via drill 0.33 pad 0.3)
  Top 0.203: v39.29,26.87 40.97,25.2 40.97,23.98 41.96,22.99 42.55,22.4 42.55,17.6 41.4,16.46 41.33,16.46 38.94,16.46 36.55,14.07 35.84,13.36 34.39,13.36 33.93,12.9 33.93,12.65 33.93,10.16 K100.67 33.85,7.55 R211.1
  Bottom 0.203: 36.3,30.94 34.09,33.15 34.09,49.76 34.09,50.22 30.1,54.2 27.84,54.2 J200.8 | 36.3,30.94 36.65,30.58 | v39.29,26.87 39.29,27.94 36.3,30.94
GPIO3_7  (via drill 0.33 pad 0.13)
  Top 0.203: K100.197 72.85,7.71 R266.2 73.18,7.67 73.41,7.9 74.17,7.9 74.22,7.9 74.5,7.62 74.57,7.54 74.57,6.2 v74.57,5.64 | R438.1 89.09,45.48 v89.97,46.35
  Bottom 0.203: v89.97,46.35 88.85,45.24 88.85,34.98 88.85,33.43 88.85,33.17 88.85,27.36 91.72,24.49 91.72,23.11 90.88,22.28 90.88,8.53 90.88,6.86 88.39,4.37 80.9,4.37 79.63,5.64 79.07,5.64 v74.57,5.64
GPIO3_9  (via drill 0.33 pad 0.25)
  Top 0.203: R203.2 28.8,23.16 29.35,22.61 K100.52 29.36,20.27 29.36,16.87 v29.59,16.64
  Bottom 0.203: J201.20 48.64,2.92 48.64,5.26 48.06,5.84 48.06,6.86 45.95,8.97 30.2,8.97 29.44,9.73 29.44,15.98 29.44,16.48 v29.59,16.64
GPIO3_10  (via drill 0.33 pad 0.13)
  Top 0.203: K100.53 29.65,7.35 R204.2 29.59,7.01 30.18,6.43 30.2,6.4 50.39,6.4 50.95,6.4 v51.23,6.12
  Bottom 0.203: v51.23,6.12 51.23,2.87 J201.21
GPIO3_18  (via drill 0.33 pad 0.25)
  Top 0.203: R218.1 K100.86 39.55,18.06 39.95,17.65 v41.15,17.65 | J201.33 82.58,1.65 81.1,3.12 75.18,9.04 v75.18,13.84
  Bottom 0.203: v41.15,17.65 41.53,17.65 61.87,17.65 63.48,16.05 72.31,16.05 72.97,16.05 v75.18,13.84
GPIO3_19  (via drill 0.33 pad 0.25)
  Top 0.203: R219.1 K100.87 39.85,11.71 39.85,11.86 v40.44,12.45 | J201.34 84.3,2.82 82.12,2.82 82.12,2.92 75.95,9.09 v75.95,12.45
  Bottom 0.203: v40.44,12.45 74.75,12.45 v75.95,12.45
GPIO3_20  (via drill 0.33 pad 0.25)
  Top 0.203: R216.2 38.95,22.84 K100.84 38.94,20.26 38.94,19 38.96,18.97 v38.96,17.58 | J201.31 77.85,5.03 75.26,7.62 73.94,8.94 73.94,12.47 73.08,13.34 v73.08,13.84
  Bottom 0.203: v38.96,17.58 39.37,17.17 40.62,17.17 40.77,17.02 41.35,17.02 41.71,17.02 41.86,17.17 61.7,17.17 63.2,15.67 71.25,15.67 v73.08,13.84
GPIO3_21  (via drill 0.33 pad 0.25)
  Top 0.203: R217.2 39.25,7.43 K100.85 39.25,12.53 v39.5,12.78 39.5,12.75 39.27,12.52 | J201.32 80.39,3.15 79.78,3.76 | 79.78,3.76 79.45,4.09 | v74.42,13.08 74.42,9.12 79.78,3.76
  Bottom 0.203: v39.5,12.78 39.8,13.08 v74.42,13.08
I2C1_SCL  (via drill 0.33 pad 0.25)
  Top 0.203: 26.95,23.04 R201.1 26.92,20.28 K100.44 26.95,18.11 v26.95,17.7
  Bottom 0.203: v26.95,17.7 26.92,17.68 26.92,17.09 26.92,17.07 27.03,16.97 28.42,16.97 28.63,16.76 28.8,16.59 28.8,16.28 28.8,15.21 28.8,9.83 28.8,9.07 30.48,7.39 38.41,7.39 40.44,5.36 40.44,3.5 41,2.95 J201.17
I2C1_SDA  (via drill 0.33 pad 0.13)
  Top 0.203: K100.47 27.85,7.36 R202.2 27.79,6.76 v28.47,6.07
  Bottom 0.203: v28.47,6.07 28.47,5.21 28.47,4.78 29.59,3.66 29.67,3.58 30.1,3.58 30.96,3.58 31.67,2.87 32.94,2.87 33.4,2.41 33.4,0.66 33.55,0.51 39.04,0.51 39.75,1.22 J201.16
I2C2_SCL  (via drill 0.33 pad 0.25)